# Altium schematic sheet AT91.SchDoc
size 320 x 228 mm; DocumentNumber: 1; SheetNumber: 1; SheetTotal: 5
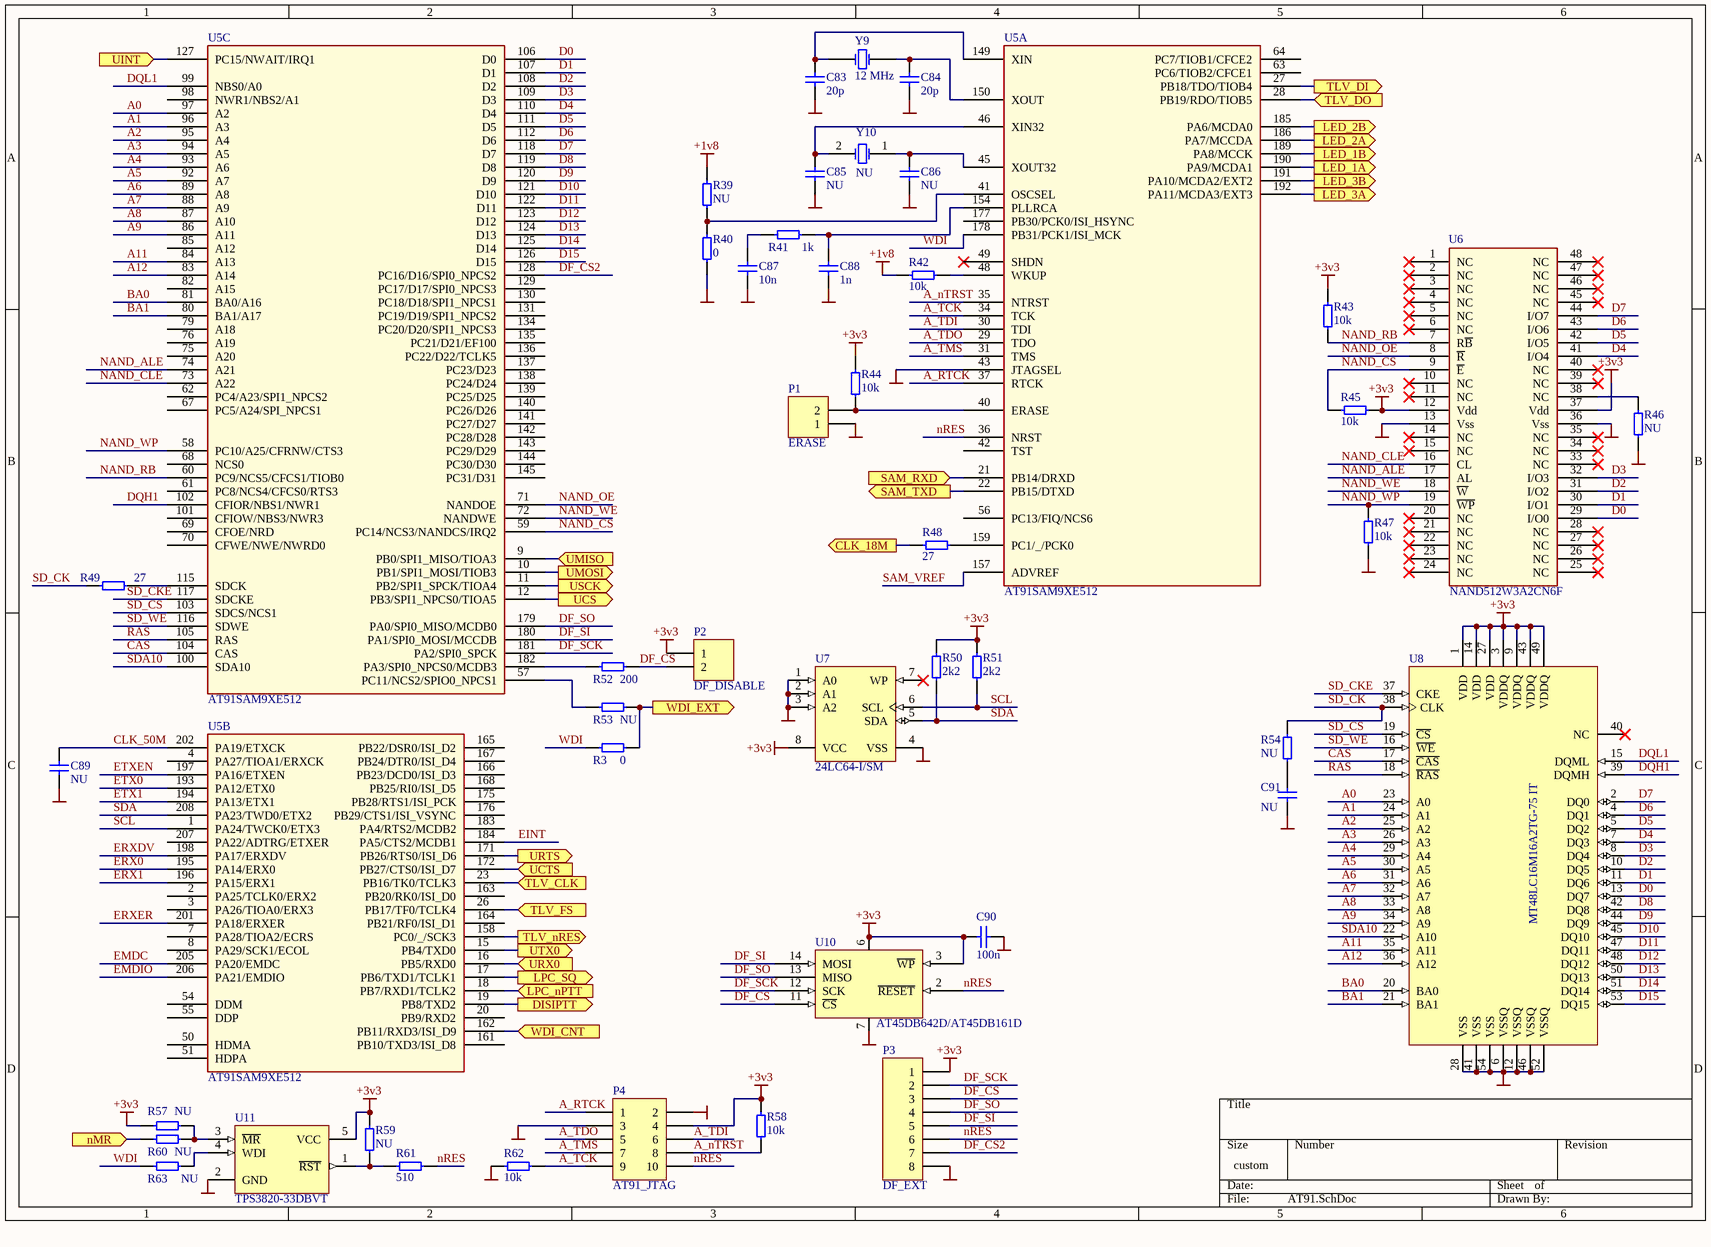
[diagram p0: AT91.SchDoc]

## Parts
C83  20p  [CAPC1608L]
C84  20p  [CAPC1608L]
C85  NU  [CAPC1608L]
C86  NU  [CAPC1608L]
C87  10n  [CAPC1608L]
C88  1n  [CAPC1608L]
C89  NU  [CAPC1608L]
C90  100n  [CAPC1608N]
C91  NU  [CAPC1608L]
P1  ERASE  [HDR1X2]
P2  DF_DISABLE  [HDR1X2]
P3  DF_EXT  [HDR1X8]
P4  AT91_JTAG  [HDR2X5]
R3  0  [RESC1608L]
R39  NU  [RESC1608L]
R40  0  [RESC1608L]
R41  1k  [RESC1608L]
R42  10k  [RESC1608L]
R43  10k  [RESC1608L]
R44  10k  [RESC1608L]
R45  10k  [RESC1608L]
R46  NU  [RESC1608L]
R47  10k  [RESC1608L]
R48  27  [RESC1608L]
R49  27  [RESC1608L]
R50  2k2  [RESC1608L]
R51  2k2  [RESC1608L]
R52  200  [RESC1608L]
R53  NU  [RESC1608L]
R54  NU  [RESC1608L]
R57  NU  [RESC1608L]
R58  10k  [RESC1608L]
R59  NU  [RESC1608L]
R60  NU  [RESC1608L]
R61  510  [RESC1608L]
R62  10k  [RESC1608L]
R63  NU  [RESC1608L]
U5  AT91SAM9XE512  [SQFP50P3120X3120-208N]  (parts A,B,C of 4)
U6  NAND512W3A2CN6F  [TSSOP50P2000-48AN]
U7  24LC64-I/SM  [SOIJ-SM8_L]
U8  MT48LC16M16A2TG-75 IT  [SOP80P1176-54N]
U10  AT45DB642D/AT45DB161D  [TSSOP55P1340-28BN]
U11  TPS3820-33DBVT  [SOT23-5]
Y9  12 MHz  [HC49/S]
Y10  NU  [R38]

## Ports
CLK_18M (out), DISIPTT (out), LED_1A (out), LED_1B (out), LED_2A (out), LED_2B (out), LED_3A (out), LED_3B (out), LPC_nPTT (in), LPC_SQ (out), nMR (in), SAM_RXD (in), SAM_TXD (out), TLV_CLK (in), TLV_DI (out), TLV_DO (in), TLV_FS (in), TLV_nRES (out), UCS (out), UCTS (in), UINT (in), UMISO (in), UMOSI (out), URTS (out), URX0 (in), USCK (out), UTX0 (out), WDI_CNT (in), WDI_EXT (out)

## Nets
+1v8: R39.2 R42.2
+3v3: C90.2 P2.1 P3.1 P4.4 R43.2 R44.2 R45.1 R50.2 R51.2 R57.1 R58.2 R59.2 U6.12(Vdd) U6.37(Vdd) U7.8(VCC) U8.1(VDD) U8.3(VDDQ) U8.9(VDDQ) U8.14(VDD) U8.27(VDD) U8.43(VDDQ) U8.49(VDDQ) U10.3(~{WP}) U10.6(VCC) U11.5(VCC)
GND: C83.2 C84.2 C85.2 C86.2 C87.2 C88.2 C89.1 C90.1 C91.1 P1.1 P3.8 P4.2 P4.3 R40.1 R46.2 R47.1 R62.2 U5.43(JTAGSEL) U6.13(Vss) U6.36(Vss) U7.1(A0) U7.2(A1) U7.3(A2) U7.4(VSS) U8.6(VSSQ) U8.12(VSSQ) U8.28(VSS) U8.41(VSS) U8.46(VSSQ) U8.52(VSSQ) U8.54(VSS) U10.7(GND) U11.2(GND)
A0: U5.97(A2) U8.23(A0)
A1: U5.96(A3) U8.24(A1)
A2: U5.95(A4) U8.25(A2)
A3: U5.94(A5) U8.26(A3)
A4: U5.93(A6) U8.29(A4)
A5: U5.92(A7) U8.30(A5)
A6: U5.89(A8) U8.31(A6)
A7: U5.88(A9) U8.32(A7)
A8: U5.87(A10) U8.33(A8)
A9: U5.86(A11) U8.34(A9)
A11: U5.84(A13) U8.35(A11)
A12: U5.83(A14) U8.36(A12)
A_nTRST: P4.8 R58.1 U5.35(NTRST)
A_RTCK: P4.1 U5.37(RTCK)
A_TCK: P4.9 R62.1 U5.34(TCK)
A_TDI: P4.6 U5.30(TDI)
A_TDO: P4.5 U5.29(TDO)
A_TMS: P4.7 U5.31(TMS)
BA0: U5.81(BA0/A16) U8.20(BA0)
BA1: U5.80(BA1/A17) U8.21(BA1)
CAS: U5.104(CAS) U8.17(~{CAS})
CLK_18M: R48.2 ; port CLK_18M
CLK_50M: C89.2 U5.202(PA19/ETXCK)
D0: U5.106(D0) U6.29(I/O0) U8.13(DQ7)
D1: U5.107(D1) U6.30(I/O1) U8.11(DQ6)
D2: U5.108(D2) U6.31(I/O2) U8.10(DQ5)
D3: U5.109(D3) U6.32(I/O3) U8.8(DQ4)
D4: U5.110(D4) U6.41(I/O4) U8.7(DQ3)
D5: U5.111(D5) U6.42(I/O5) U8.5(DQ2)
D6: U5.112(D6) U6.43(I/O6) U8.4(DQ1)
D7: U5.118(D7) U6.44(I/O7) U8.2(DQ0)
D8: U5.119(D8) U8.42(DQ8)
D9: U5.120(D9) U8.44(DQ9)
D10: U5.121(D10) U8.45(DQ10)
D11: U5.122(D11) U8.47(DQ11)
D12: U5.123(D12) U8.48(DQ12)
D13: U5.124(D13) U8.50(DQ13)
D14: U5.125(D14) U8.51(DQ14)
D15: U5.126(D15) U8.53(DQ15)
DF_CS: P2.2 P3.3 R52.1 U10.11(~{CS})
DF_CS2: P3.7 U5.128(PC16/D16/SPI0_NPCS2)
DF_SCK: P3.2 U5.181(PA2/SPI0_SPCK) U10.12(SCK)
DF_SI: P3.5 U5.180(PA1/SPI0_MOSI/MCCDB) U10.14(MOSI)
DF_SO: P3.4 U5.179(PA0/SPI0_MISO/MCDB0) U10.13(MISO)
DISIPTT: U5.19(PB8/TXD2) ; port DISIPTT
DQH1: U5.102(CFIOR/NBS1/NWR1) U8.39(DQMH)
DQL1: U5.99(NBS0/A0) U8.15(DQML)
EINT: U5.184(PA5/CTS2/MCDB1)
EMDC: U5.205(PA20/EMDC)
EMDIO: U5.206(PA21/EMDIO)
ERX0: U5.195(PA14/ERX0)
ERX1: U5.196(PA15/ERX1)
ERXDV: U5.198(PA17/ERXDV)
ERXER: U5.201(PA18/ERXER)
ETX0: U5.193(PA12/ETX0)
ETX1: U5.194(PA13/ETX1)
ETXEN: U5.197(PA16/ETXEN)
LED_1A: U5.190(PA9/MCDA1) ; port LED_1A
LED_1B: U5.189(PA8/MCCK) ; port LED_1B
LED_2A: U5.186(PA7/MCCDA) ; port LED_2A
LED_2B: U5.185(PA6/MCDA0) ; port LED_2B
LED_3A: U5.192(PA11/MCDA3/EXT3) ; port LED_3A
LED_3B: U5.191(PA10/MCDA2/EXT2) ; port LED_3B
LPC_nPTT: U5.18(PB7/RXD1/TCLK2) ; port LPC_nPTT
LPC_SQ: U5.17(PB6/TXD1/TCLK1) ; port LPC_SQ
NAND_ALE: U5.74(A21) U6.17(AL)
NAND_CLE: U5.73(A22) U6.16(CL)
NAND_CS: R45.2 U5.59(PC14/NCS3/NANDCS/IRQ2) U6.9(~{E})
NAND_OE: U5.71(NANDOE) U6.8(~{R})
NAND_RB: R43.1 U5.60(PC9/NCS5/CFCS1/TIOB0) U6.7(R~{B})
NAND_WE: U5.72(NANDWE) U6.18(~{W})
NAND_WP: R47.2 U5.58(PC10/A25/CFRNW/CTS3) U6.19(~{WP})
nMR: R60.1 ; port nMR
nRES: P3.6 P4.10 R61.1 U5.36(NRST) U10.2(~{RESET})
RAS: U5.105(RAS) U8.18(~{RAS})
SAM_RXD: U5.21(PB14/DRXD) ; port SAM_RXD
SAM_TXD: U5.22(PB15/DTXD) ; port SAM_TXD
SAM_VREF: U5.157(ADVREF)
SCL: R51.1 U5.1(PA24/TWCK0/ETX3) U7.6(SCL)
SD_CK: R49.2 R54.2 U8.38(CLK)
SD_CKE: U5.117(SDCKE) U8.37(CKE)
SD_CS: U5.103(SDCS/NCS1) U8.19(~{CS})
SD_WE: U5.116(SDWE) U8.16(~{WE})
SDA: R50.1 U5.208(PA23/TWD0/ETX2) U7.5(SDA)
SDA10: U5.100(SDA10) U8.22(A10)
TLV_CLK: U5.23(PB16/TK0/TCLK3) ; port TLV_CLK
TLV_DI: U5.27(PB18/TDO/TIOB4) ; port TLV_DI
TLV_DO: U5.28(PB19/RDO/TIOB5) ; port TLV_DO
TLV_FS: U5.26(PB17/TF0/TCLK4) ; port TLV_FS
TLV_nRES: U5.158(PC0/_/SCK3) ; port TLV_nRES
UCS: U5.12(PB3/SPI1_NPCS0/TIOA5) ; port UCS
UCTS: U5.172(PB27/CTS0/ISI_D7) ; port UCTS
UINT: U5.127(PC15/NWAIT/IRQ1) ; port UINT
UMISO: U5.9(PB0/SPI1_MISO/TIOA3) ; port UMISO
UMOSI: U5.10(PB1/SPI1_MOSI/TIOB3) ; port UMOSI
URTS: U5.171(PB26/RTS0/ISI_D6) ; port URTS
URX0: U5.16(PB5/RXD0) ; port URX0
USCK: U5.11(PB2/SPI1_SPCK/TIOA4) ; port USCK
UTX0: U5.15(PB4/TXD0) ; port UTX0
WDI: R3.1 R63.2 U5.178(PB31/PCK1/ISI_MCK)
WDI_CNT: U5.162(PB11/RXD3/ISI_D9) ; port WDI_CNT
WDI_EXT: R3.2 R53.2 ; port WDI_EXT
NetC83_1: C83.1 U5.149(XIN) Y9.1(OSC1)
NetC84_1: C84.1 U5.150(XOUT) Y9.2(OSC2)
NetC85_1: C85.1 U5.46(XIN32) Y10.2(OSC2)
NetC86_1: C86.1 U5.45(XOUT32) Y10.1(OSC1)
NetC87_1: C87.1 R41.2
NetC88_1: C88.1 R41.1 U5.154(PLLRCA)
NetC91_2: C91.2 R54.1
NetP1_2: P1.2 R44.1 U5.40(ERASE)
NetR39_1: R39.1 R40.2 U5.41(OSCSEL)
NetR42_1: R42.1 U5.48(WKUP)
NetR46_1: R46.1 U6.38(NC)
NetR48_1: R48.1 U5.159(PC1/_/PCK0)
NetR49_1: R49.1 U5.115(SDCK)
NetR52_2: R52.2 U5.182(PA3/SPI0_NPCS0/MCDB3)
NetR53_1: R53.1 U5.57(PC11/NCS2/SPIO0_NPCS1)
NetR57_2: R57.2 R60.2 U11.3(~{MR})
NetR59_1: R59.1 R61.2 U11.1(~{RST})
NetR63_1: R63.1 U11.4(WDI)

Not connected (* = marked no-connect by the designer): U5 2(PA25/TCLK0/ERX2) 3(PA26/TIOA0/ERX3) 4(PA27/TIOA1/ERXCK) 7(PA28/TIOA2/ECRS) 8(PA29/SCK1/ECOL) 20(PB9/RXD2) 42(TST) 49(SHDN)* 50(HDMA) 51(HDPA) 54(DDM) 55(DDP) 56(PC13/FIQ/NCS6) 61(PC8/NCS4/CFCS0/RTS3) 62(PC4/A23/SPI1_NPCS2) 63(PC6/TIOB2/CFCE1) 64(PC7/TIOB1/CFCE2) 67(PC5/A24/SPI_NPCS1) 68(NCS0) 69(CFOE/NRD) 70(CFWE/NWE/NWRD0) 75(A20) 76(A19) 79(A18) 82(A15) 85(A12) 98(NWR1/NBS2/A1) 101(CFIOW/NBS3/NWR3) 129(PC17/D17/SPI0_NPCS3) 130(PC18/D18/SPI1_NPCS1) 131(PC19/D19/SPI1_NPCS2) 134(PC20/D20/SPI1_NPCS3) 135(PC21/D21/EF100) 136(PC22/D22/TCLK5) 137(PC23/D23) 138(PC24/D24) 139(PC25/D25) 140(PC26/D26) 141(PC27/D27) 142(PC28/D28) 143(PC29/D29) 144(PC30/D30) 145(PC31/D31) 161(PB10/TXD3/ISI_D8) 163(PB20/RK0/ISI_D0) 164(PB21/RF0/ISI_D1) 165(PB22/DSR0/ISI_D2) 166(PB23/DCD0/ISI_D3) 167(PB24/DTR0/ISI_D4) 168(PB25/RI0/ISI_D5) 175(PB28/RTS1/ISI_PCK) 176(PB29/CTS1/ISI_VSYNC) 177(PB30/PCK0/ISI_HSYNC) 183(PA4/RTS2/MCDB2) 207(PA22/ADTRG/ETXER); U6 1(NC)* 2(NC)* 3(NC)* 4(NC)* 5(NC)* 6(NC)* 10(NC)* 11(NC)* 14(NC)* 15(NC)* 20(NC)* 21(NC)* 22(NC)* 23(NC)* 24(NC)* 25(NC)* 26(NC)* 27(NC)* 28(NC)* 33(NC)* 34(NC)* 35(NC)* 39(NC)* 40(NC)* 45(NC)* 46(NC)* 47(NC)* 48(NC)*; U7 7(WP)*; U8 40(NC)*

## Library data of the parts
C83-C91 = Cap: Capacitor; Value: 100pF; Published: 8-Jun-2000; LatestRevisionDate: 17-Jul-2002; LatestRevisionNote: Re-released for DXP Platform.; PackageReference: RAD-0.3; Publisher: Altium Limited
P1 P2 = Header 2: Header, 2-Pin; LatestRevisionDate: 17-Jul-2002; LatestRevisionNote: Re-released for DXP Platform.; Publisher: Altium Limited
P3 = Header 8: Header, 8-Pin; LatestRevisionDate: 17-Jul-2002; LatestRevisionNote: Re-released for DXP Platform.; Publisher: Altium Limited
P4 = Header 5X2: Header, 5-Pin, Dual row; LatestRevisionDate: 17-Jul-2002; LatestRevisionNote: Re-released for DXP Platform.; Publisher: Altium Limited
R3 R39 R40 R42-R54 R57-R63 = Res: Resistor; Value: 1K; Published: 8-Jun-2000; LatestRevisionDate: 04-Mar-2005; LatestRevisionNote: PCB Footprint replaced.; PackageReference: J1-0603; Publisher: Altium Limited
R41 = Res: Resistor; Published: 8-Jun-2000; LatestRevisionDate: 04-Mar-2005; LatestRevisionNote: PCB Footprint replaced.; PackageReference: J1-0603; Publisher: Altium Limited; Value: 1K
U6 = NAND256W3A2BN6E: 256Mbit 528B/264 Word Page , 1.8/3V NAND Flash(x8)
U7 = 24LC128-I/SM: 128Kbit, 400kHz, 2.5V, I2C Serial EEPROM, 8-Pin SOIC 208mil, Industrial Temperature; Published: 29-Jan-2009; DatasheetVersion: revQ, Jun-2008; PackageVersion: revAW, Oct-2008; PackageReference: SOIJ-SM8; Publisher: Altium Limited; PackageDescription: 8-Lead Plastic Small Outline (SM) - Medium, 5.28 mm Body [SOIJ]; ComponentLink1Description: Manufacturer Link; ComponentLink1URL: http://www.microchip.com; ComponentLink2Description: Datasheet; ComponentLink2URL: http://ww1.microchip.com/downloads/en/DeviceDoc/21191Q.pdf; ComponentLink3Description: Packaging Specification; ComponentLink3URL: http://ww1.microchip.com/downloads/en/PackagingSpec/00049AW.pdf
U8 = MT48LC16M16A2TG-75 IT: 256Mb Synchronous High-Speed CMOS DRAM, 16Mb x 16Bit x 4 Banks, 54-Pin TSOP, Industrial; CycleTime: 7.5ns @ CL = 3 (PC133); RowAddress: 8K (A0-A12); ColumnAddress: 512 (A0-A8); Published: 11-Oct-2004; LatestRevisionDate: 13-Apr-2006; LatestRevisionNote: IPC-7351 Footprint Added.; DatasheetVersion: rev.G, Sep-2003; PackageVersion: Sep-2003; PackageReference: TSOP2-54; Publisher: Altium Limited; PackageDescription: 54-Pin Plastic Small Outline Package 0.8 mm Pitch; Code_JEDEC: MS-024-FA; ComponentLink1Description: Manufacturer Link; ComponentLink1URL: http://www.micron.com; ComponentLink2Description: Datasheet; ComponentLink2URL: http://download.micron.com/pdf/datasheets/dram/sdram/256MSDRAM.pdf
U10 = AT45DB642D: 64 Mb 2.5/2.7 V DataFlash
U11 = MAX823LEUK: 5-Pin Microprocessor Supervisory Circuit; Published: 16-Jan-2001; LatestRevisionDate: 17-Jul-2002; LatestRevisionNote: Re-released for DXP Platform.; DatasheetVersion: Jun-1997; PackageReference: SOT23-5; Publisher: Altium Limited; PackageDescription: SOT-23/SC-74A; 5 Leads; Body 3 x 3 mm, inc. leads (LxW max); ComponentLink1Description: Manufacturer Link; ComponentLink1URL: http://www.maxim-ic.com/; ComponentLink2Description: Datasheet; ComponentLink2URL: http://pdfserv.maxim-ic.com/en/ds/MAX823-MAX825.pdf
Y9 Y10 = XTAL: Crystal Oscillator; Published: 8-Jun-2000; LatestRevisionDate: 17-Jul-2002; LatestRevisionNote: Re-released for DXP Platform.; PackageReference: R38; Publisher: Altium Limited